# EAGLE schematic MFOS Dual VCA Sliders (EAGLE 7.6.0)
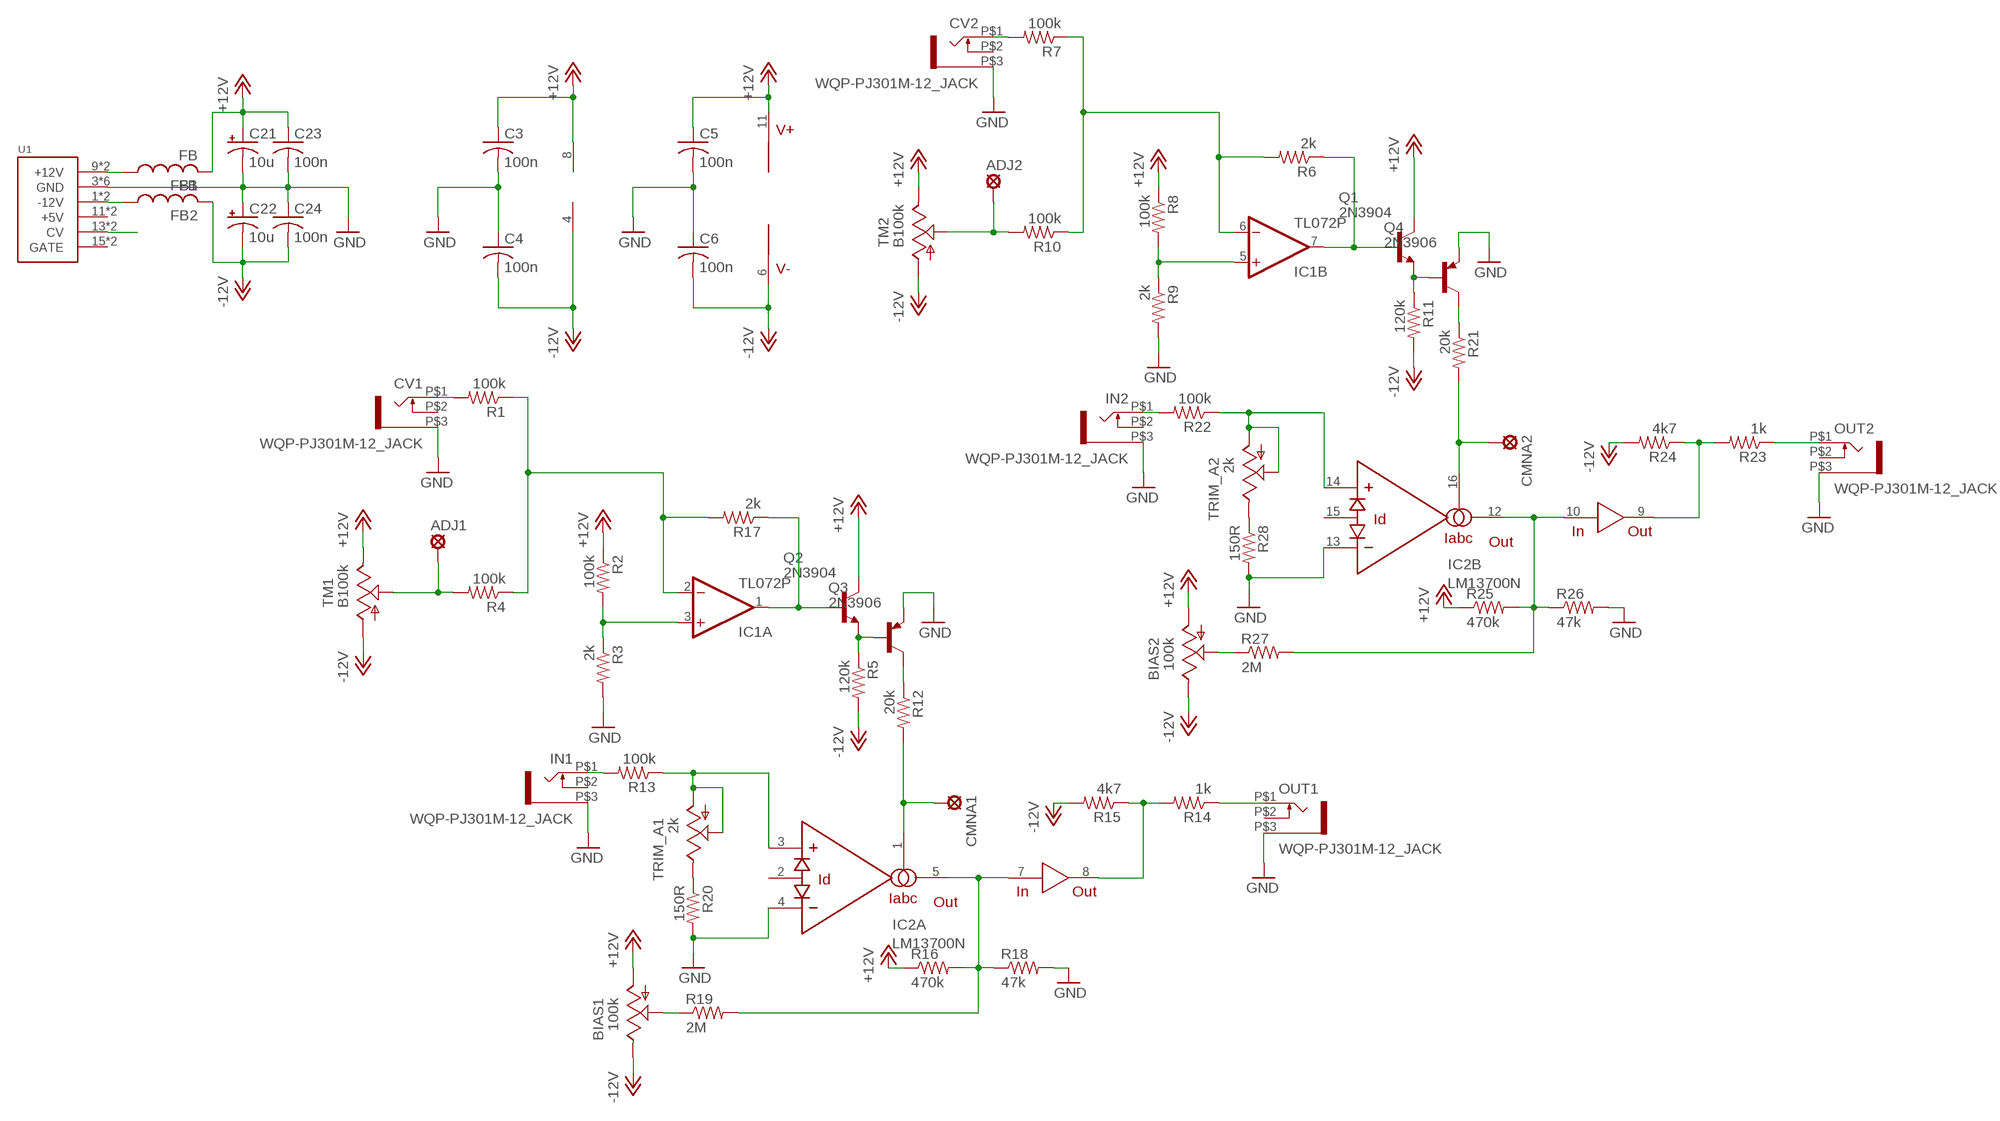
[diagram p0: schematic, sheet 1]

## Parts
ADJ1  LSP10  [LSP10]
ADJ2  LSP10  [LSP10]
BIAS1  100k  TRIM_US-B64W  [B64W]
BIAS2  100k  TRIM_US-B64W  [B64W]
C3  100n  C-USC1206  [C1206]
C4  100n  C-USC1206  [C1206]
C5  100n  C-USC1206  [C1206]
C6  100n  C-USC1206  [C1206]
C21  10u  CPOL-USB45181A  [B45181A]
C22  10u  CPOL-USB45181A  [B45181A]
C23  100n  C-US050-024X044  [C050-024X044]
C24  100n  C-US050-024X044  [C050-024X044]
CMNA1  LSP10  [LSP10]
CMNA2  LSP10  [LSP10]
CV1  WQP-PJ301M-12_JACK  [WQP-PJ301M-12_JACK]
CV2  WQP-PJ301M-12_JACK  [WQP-PJ301M-12_JACK]
FB1  FB  [FB]
FB2  FB  [FB]
IC1  TL072P  [DIL08]
IC2  LM13700N  [DIL16]
IN1  WQP-PJ301M-12_JACK  [WQP-PJ301M-12_JACK]
IN2  WQP-PJ301M-12_JACK  [WQP-PJ301M-12_JACK]
OUT1  WQP-PJ301M-12_JACK  [WQP-PJ301M-12_JACK]
OUT2  WQP-PJ301M-12_JACK  [WQP-PJ301M-12_JACK]
Q1  2N3904  [TO92]
Q2  2N3904  [TO92]
Q3  2N3906  [TO92]
Q4  2N3906  [TO92]
R1  100k  R-US_R1206  [R1206]
R2  100k  R-US_R1206  [R1206]
R3  2k  R-US_R1206  [R1206]
R4  100k  R-US_R1206  [R1206]
R5  120k  R-US_R1206  [R1206]
R6  2k  R-US_R1206  [R1206]
R7  100k  R-US_R1206  [R1206]
R8  100k  R-US_R1206  [R1206]
R9  2k  R-US_R1206  [R1206]
R10  100k  R-US_R1206  [R1206]
R11  120k  R-US_R1206  [R1206]
R12  20k  R-US_R1206  [R1206]
R13  100k  R-US_R1206  [R1206]
R14  1k  R-US_R1206  [R1206]
R15  4k7  R-US_R1206  [R1206]
R16  470k  R-US_R1206  [R1206]
R17  2k  R-US_R1206  [R1206]
R18  47k  R-US_R1206  [R1206]
R19  2M  R-US_R1206  [R1206]
R20  150R  R-US_R1206  [R1206]
R21  20k  R-US_R1206  [R1206]
R22  100k  R-US_R1206  [R1206]
R23  1k  R-US_R1206  [R1206]
R24  4k7  R-US_R1206  [R1206]
R25  470k  R-US_R1206  [R1206]
R26  47k  R-US_R1206  [R1206]
R27  2M  R-US_R1206  [R1206]
R28  150R  R-US_R1206  [R1206]
TM1  B100k  TRIMSLIDE60  [SLIDEPOT-60]
TM2  B100k  TRIMSLIDE60  [SLIDEPOT-60]
TRIM_A1  2k  TRIM_US-B64W  [B64W]
TRIM_A2  2k  TRIM_US-B64W  [B64W]
U1  POWER  [POWER_16]

## Nets
+12V: BIAS1.A BIAS2.A C3.1 C5.1 C21.+ C23.1 FB1.P$2 IC1.8(P:V+) IC2.11(V+) Q1.1(C) Q2.1(C) R2.1 R8.1 R16.1 R25.1 TM1.B TM2.B
-12V: BIAS1.E BIAS2.E C4.2 C6.2 C22.- C24.2 FB2.P$2 IC1.4(P:V-) IC2.6(V-) R5.2 R11.2 R15.2 R24.2 TM1.A TM2.A
GND: C3.2 C4.1 C5.2 C6.1 C21.- C22.+ C23.2 C24.1 CV1.P$3 CV2.P$3 IC2.4(A:-IN) IC2.13(B:-IN) IN1.P$3 IN2.P$3 OUT1.P$3 OUT2.P$3 Q3.3(E) Q4.3(E) R3.2 R9.2 R18.2 R20.2 R26.2 R28.2 U1.3(GND) U1.4(GND) U1.5(GND) U1.6(GND) U1.7(GND) U1.8(GND)
N$1: IC1.7(B:OUT) Q1.2(B) R6.1
N$2: IC1.5(B:+IN) R8.2 R9.1
N$3: CV1.P$1 R1.2
N$4: CV2.P$1 R7.2
N$5: ADJ1.MP R4.2 TM1.WIPER
N$6: IC1.2(A:-IN) R1.1 R4.1 R17.2
N$7: Q2.3(E) Q3.2(B) R5.1
N$8: IC1.1(A:OUT) Q2.2(B) R17.1
N$9: ADJ2.MP R10.2 TM2.WIPER
N$10: IC1.6(B:-IN) R6.2 R7.1 R10.1
N$11: IC1.3(A:+IN) R2.2 R3.1
N$12: Q3.1(C) R12.1
N$13: IN1.P$1 R13.2
N$14: Q1.3(E) Q4.2(B) R11.1
N$15: Q4.1(C) R21.1
N$16: CMNA1.MP IC2.1(A:IABC) R12.2
N$17: IN2.P$1 R22.2
N$18: BIAS1.P$1(S) BIAS1.S R19.1
N$19: OUT1.P$1 R14.1
N$20: IC2.8(OUT) R14.2 R15.1
N$21: IC2.5(A:OUT) IC2.7(IN) R16.2 R18.1 R19.2
N$22: R20.1 TRIM_A1.E
N$23: IC2.3(A:+IN) R13.1 TRIM_A1.A TRIM_A1.P$1(S) TRIM_A1.S
N$24: CMNA2.MP IC2.16(B:IABC) R21.2
N$25: IC2.9(OUT) R23.2 R24.1
N$26: OUT2.P$1 R23.1
N$27: IC2.10(IN) IC2.12(B:OUT) R25.2 R26.1 R27.2
N$28: BIAS2.P$1(S) BIAS2.S R27.1
N$29: R28.1 TRIM_A2.E
N$30: IC2.14(B:+IN) R22.1 TRIM_A2.A TRIM_A2.P$1(S) TRIM_A2.S
N$55: U1.13(CV) U1.14(CV)
N$61: FB1.P$1 U1.9(+12V) U1.10(+12V)
N$62: FB2.P$1 U1.1(-12V) U1.2(-12V)
Unconnected: CV1.P$2 CV2.P$2 IC2.2(A:ID) IC2.15(B:ID) IN1.P$2 IN2.P$2 OUT1.P$2 OUT2.P$2 U1.11(+5V) U1.12(+5V) U1.15(GATE) U1.16(GATE)

## Library data of the parts
ADJ1 ADJ2 CMNA1 CMNA2 = solpad:LSP10: SOLDER PAD drill 1.0 mm, distributor Buerklin, 12H555
BIAS1 BIAS2 TRIM_A1 TRIM_A2 = pot:TRIM_US-: POTENTIOMETER
C3-C6 C23 C24 = rcl:C-US: CAPACITOR, American symbol
C21 C22 = rcl:CPOL-US: POLARIZED CAPACITOR, American symbol
CV1 CV2 IN1 IN2 OUT1 OUT2 = thonkiconn:WQP-PJ301M-12_JACK
FB1 FB2 = adafruit:FB: Ferrite bead Digikey #P9821BK-ND
IC1 = linear:TL072: OP AMP
IC2 = synthdiy updated imperial:LM13700: National Dual OTA with buffers.
Q1 Q2 = transistor-npn:2N3904: NPN Transistor
Q3 Q4 = transistor-pnp:2N3906: PNP Transistor
R1-R28 = rcl:R-US_: RESISTOR, American symbol
TM1 TM2 = stefan-lochbrunner_EAGLE_master_custom libraries_potentiometers_Bourns PTA series_Bourns PTA series:TRIM: Sliding potentiometers Based on Adafruits (https://github.com/adafruit/Adafruit-Eagle-Library) 'TRIM' device. For Bourns PTA series and TT Electronics PSxx series potentiometers.
U1 = eurorack:POWER